# EAGLE design ReceiverR3 (EAGLE 8.4.2)
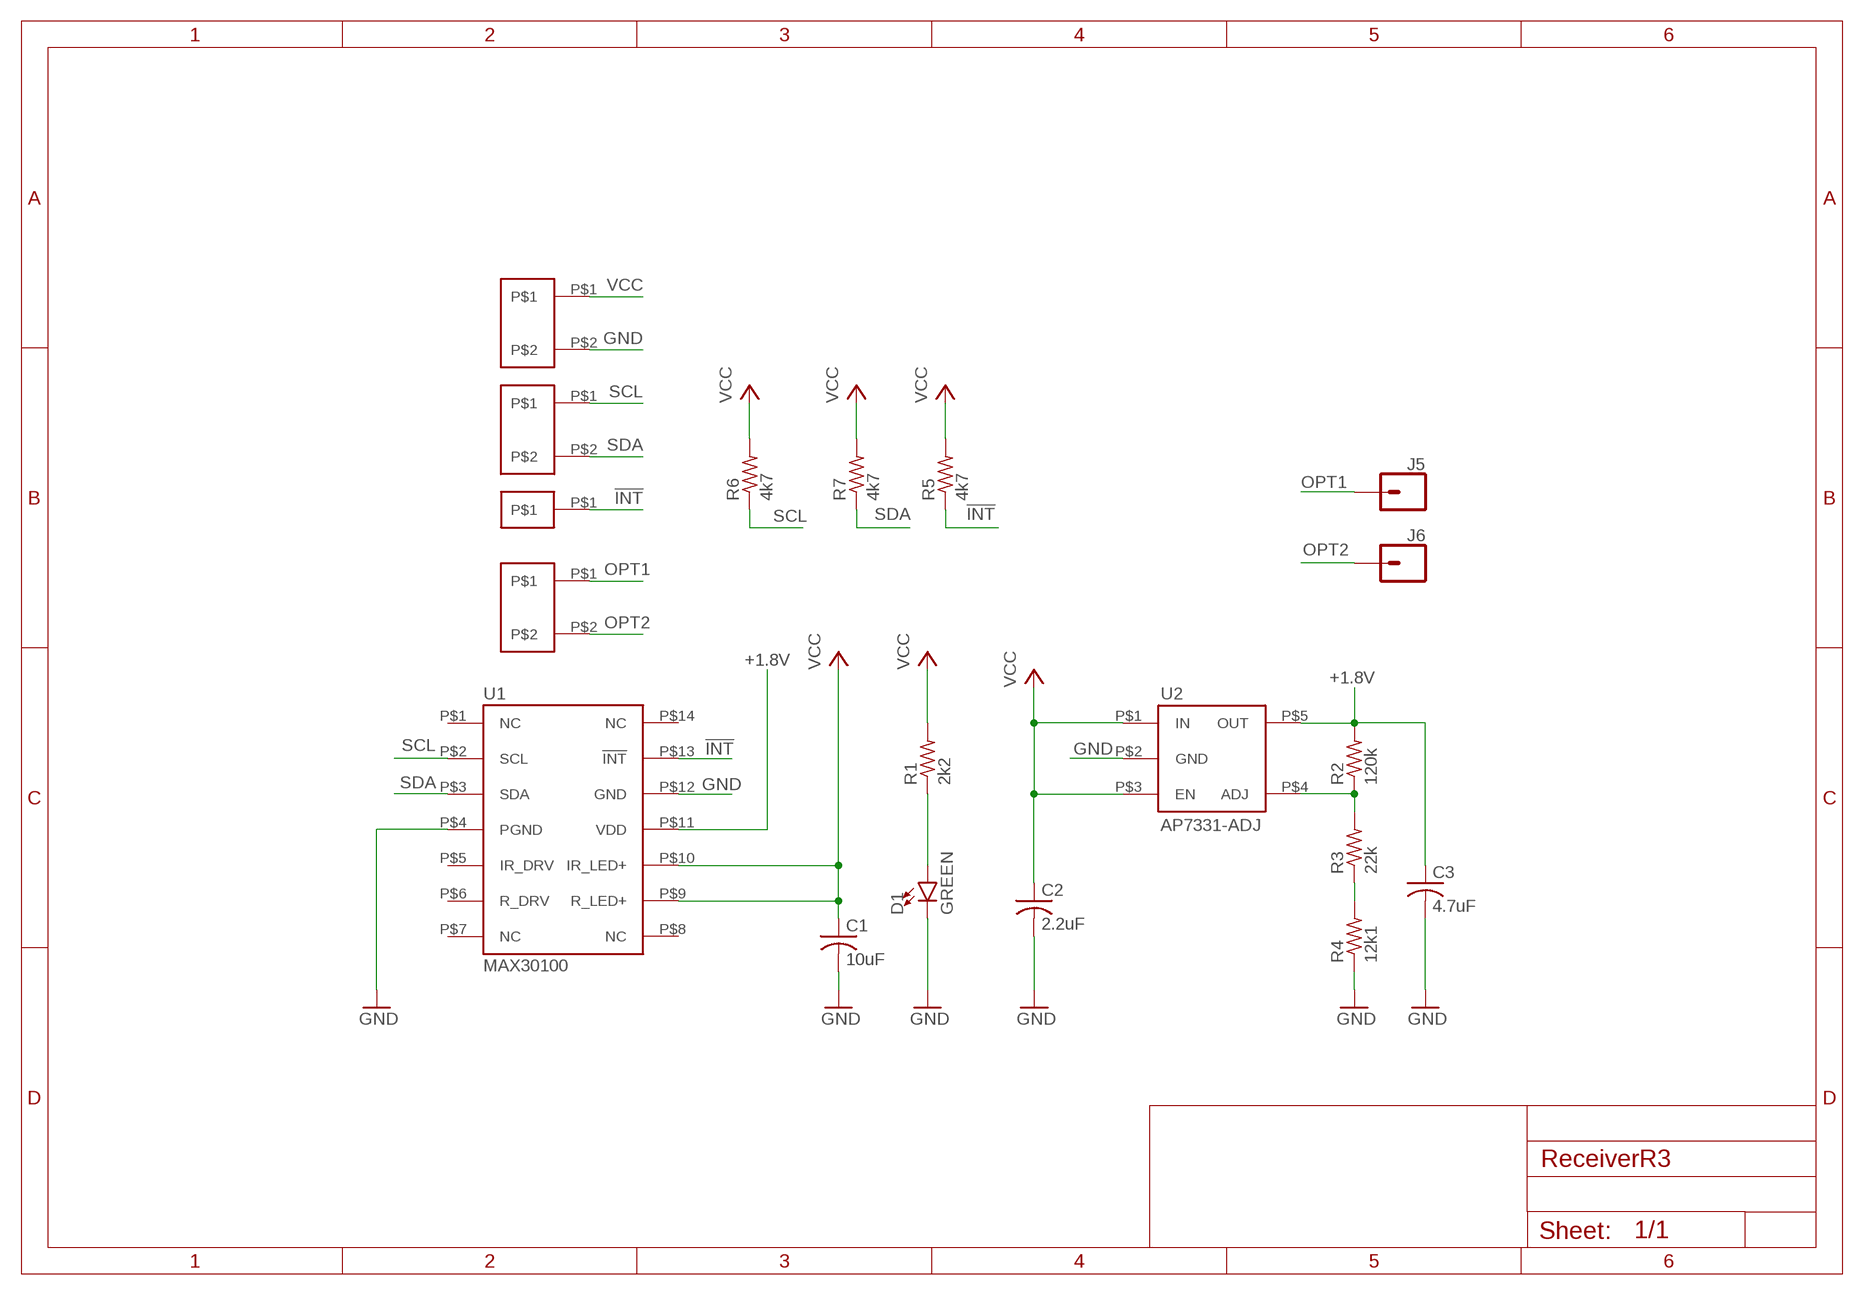
[diagram p0: schematic, sheet 1]

## Parts
C1  10uF  C-USC0805  [C0805]
C2  2.2uF  C-USC0805  [C0805]
C3  4.7uF  C-USC0805  [C0805]
D1  GREEN  LED-GREEN0603  [LED-0603]
J1  SOLDERPAD1X2  [SOLDERPAD1X2]
J2  SOLDERPAD1X2  [SOLDERPAD1X2]
J3  SOLDERPAD1X2  [SOLDERPAD1X2]
J4  SOLDERPAD1X1  [SOLDERPAD1X1]
J5  CONN_01  [1X01]
J6  CONN_01  [1X01]
R1  2k2  R-US_R0805  [R0805]
R2  120k  R-US_R0805  [R0805]
R3  22k  R-US_R0805  [R0805]
R4  12k1  R-US_R0805  [R0805]
R5  4k7  R-US_R0805  [R0805]
R6  4k7  R-US_R0805  [R0805]
R7  4k7  R-US_R0805  [R0805]
U1  MAX30100  [14OESIP]
U2  AP7331-ADJ  [SOT25]

## Nets
!INT!: J4.P$1 R5.1 U1.P$13(!INT!)
+1.8V: C3.1 R2.2 U1.P$11(VDD) U2.P$5(OUT)
GND: C1.2 C2.2 C3.2 D1.C J2.P$2 R4.1 U1.P$4(PGND) U1.P$12(GND) U2.P$2(GND)
N$1: D1.A R1.1
N$2: R2.1 R3.2 U2.P$4(ADJ)
N$3: R3.1 R4.2
OPT1: J1.P$1 J5.1
OPT2: J1.P$2 J6.1
SCL: J3.P$1 R6.1 U1.P$2(SCL)
SDA: J3.P$2 R7.1 U1.P$3(SDA)
VCC: C1.1 C2.1 J2.P$1 R1.2 R5.2 R6.2 R7.2 U1.P$9(R_LED+) U1.P$10(IR_LED+) U2.P$1(IN) U2.P$3(EN)
Unconnected: U1.P$1(NC) U1.P$5(IR_DRV) U1.P$6(R_DRV) U1.P$7(NC) U1.P$8(NC) U1.P$14(NC)

## Library data of the parts
C1-C3 = rcl:C-US: CAPACITOR, American symbol
D1 = SparkFun-LED:LED-GREEN: Green SMD LED Used in manufacturing of various products at SparkFun Packages: 0603 - SMD 0603 package [Product Link] <http://www.futureelectronics.com/en/technologies/semiconductors/optoelectronics/leds/Pages/9894312-LTST-C190GKT.aspx?CrossPart=HSMG-C190&IM=0> LilyPad 1206 - SMD1206 LilyPad package [Product Link] <http://www.futureelectronics.com/en/Technologies/Product.aspx?ProductID=IN150NGHARVATEKCORPORATION2049943&IM=0> 1206 - SMD1206 package [Product Link] <http://www.futureelectronics.com/en/technologies/semiconductors/optoelectronics/leds/Pages/8315665-LTST-C150KGKT.aspx?IM=0> 1206 Bottom Mount -SMD 1206 Bottom Mount [Product Link] <http://www.digikey.com/product-detail/en/lite-on-inc/LTST-C230KGKT/160-1456-1-ND/386854> SparkFun Products: Pro Mini 328 -5V <https://www.sparkfun.com/products/821> RedBoard <https://www.sparkfun.com/products/12757> MP3 Trigger <https://www.sparkfun.com/products/13720> Makey Makey <https://www.sparkfun.com/products/11076>; PROD_ID: DIO-00821
J1-J3 = CustomLibrary:SOLDERPAD1X2
J4 = CustomLibrary:SOLDERPAD1X1
J5 J6 = SparkFun-Connectors:CONN_01: Single connection point. Often used as Generic Header-pin footprint for 0.1 inch spaced/style header connections On any of the 0.1 inch spaced packages, you can populate with these: Break Away Headers - Straight <https://www.sparkfun.com/products/116> (PRT-00116) Break Away Male Headers - Right Angle <https://www.sparkfun.com/products/553> (PRT-00553) Female Headers <https://www.sparkfun.com/products/115> (PRT-00115) Break Away Headers - Machine Pin <https://www.sparkfun.com/products/117> (PRT-00117) Break Away Female Headers - Swiss Machine Pin <https://www.sparkfun.com/products/743> (PRT-00743) This device is also useful as a general connection point to wire up your design to another part of your project. Our various solder wires solder well into these plated through hole pads. Hook-Up Wire - Assortment (Stranded, 22 AWG) <https://www.sparkfun.com/products/11375> (PRT-11375) Hook-Up Wire - Assortment (Solid Core, 22 AWG) <https://www.sparkfun.com/products/11367> (PRT-11367) View the entire wire category on our website here <https://www.sparkfun.com/categories/141> Special notes: SMTSO-256-ET is a "flush mount" nut for a 4-40 screw. We mostly use this on specialty testbeds; it is a nice way to connect hardware to your PCB at an adjustable hieght. Also note, the SNAP packages are for using a snappable style connector. We sell a baggie of snaps and they are also used on two LilyPad designs: Snap Assortment - 30 pack (male and female) <https://www.sparkfun.com/products/11347> (DEV-11347) LilyPad Arduino SimpleSnap <https://www.sparkfun.com/products/10941> (DEV-10941) LilyPad SimpleSnap Protoboard <https://www.sparkfun.com/products/10940> (DEV-10940)
R1-R7 = rcl:R-US_: RESISTOR, American symbol
U1 = CustomLibrary:MAX30100: MAX30100
U2 = CustomLibrary:AP7331-ADJ: AP7331-ADJ

## Board
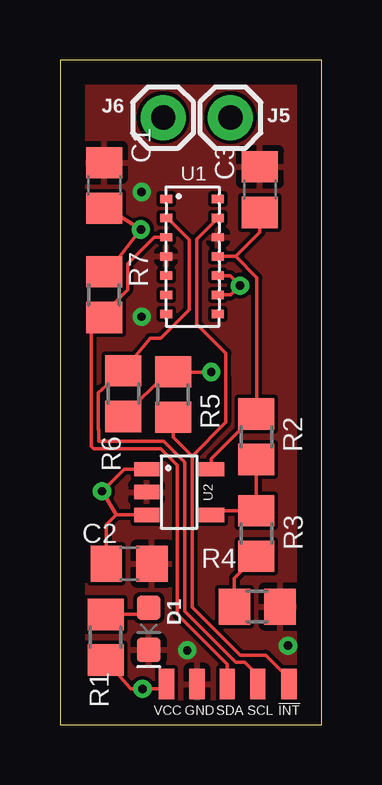
[diagram p1: board, top side]
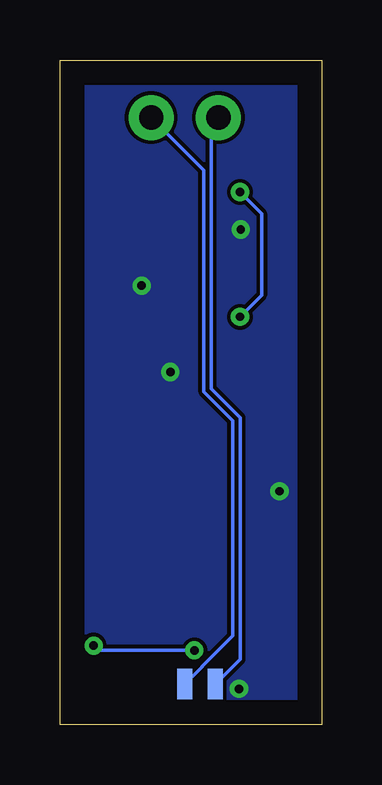
[diagram p2: board, bottom side, seen from below]

Size 10.9 x 27.7 mm. Coordinates in mm from the lower left corner, seen from the top.
Outline: 0,0 10.9,0 10.9,27.7 0,27.7 0,0
Copper layers (1*16): Top 0.035mm / dielectric 1.5mm / Bottom 0.035mm
Design rules "default": minimum track width 6mil, minimum drill 0.35mm, track to track 6mil, track to pad 6mil, pad to pad 6mil, via to via 6mil, smd to smd 6mil, copper to edge 40mil, drill to drill 6mil, minimum pad ring 10mil, minimum via ring 8mil, stop-mask expansion 4mil, vias tented up to drill 0mil, thermal gap 10mil

### Footprints (pad centres in the part's own frame; a part is rotated, then mirrored left to right if it is on the bottom)
C0805 = smd 1.3 x 1.5: 1 -0.95,0; 2 0.95,0
LED-0603 = smd 1 x 1: A -0.877,0; C 0.877,0
SOLDERPAD1X2 = smd 1.27 x 0.635: P$1 0,0; P$2 0,-1.27
SOLDERPAD1X1 = smd 1.27 x 0.635: P$1 0,0
1X01 = drill 1.016 pad 1.88: 1 0,0
R0805 = smd 1.3 x 1.5: 1 -0.95,0; 2 0.95,0
14OESIP = smd 0.5 x 0.35: P$1 0,0; P$2 0,-0.8; P$3 0,-1.6; P$4 0,-2.4; P$5 0,-3.2; P$6 0,-4; P$7 0,-4.8; P$8 2.15,-4.8; P$9 2.15,-4; P$10 2.15,-3.2; P$11 2.15,-2.4; P$12 2.15,-1.6; P$13 2.15,-0.8; P$14 2.15,0
SOT25 = smd 0.6 x 1.05: P$1 0,0; P$2 0.95,0; P$3 1.9,0; P$4 1.9,2.7; P$5 0,2.7

### Placement (x,y rotation side)
C1  1.84,22.47 90 top
C2  2.88,6.71 0 top
C3  8.33,22.3 90 top
D1  3.7,4 270 top
J1  5.7,1.7 90 bottom
J2  4.44,1.7 90 top
J3  8.24,1.7 270 top
J4  9.54,1.7 90 top
J5  7.1,25.3 0 top
J6  4.3,25.3 0 top
R1  1.9,3.65 270 top
R2  8.18,12 90 top
R3  8.18,7.97 90 top
R4  8.22,4.92 180 top
R5  4.71,13.76 90 top
R6  2.65,13.8 270 top
R7  1.84,17.92 90 top
U1  4.43,21.91 0 top
U2  3.61,10.65 270 top

### Tracks (layer width: path | path; a pad name or v marks a point on that pad's centre or on a via)
!INT!
  Top 0.152: U1.P$13 5.7,20.23 5.7,16.7 6.91,15.49 6.91,14.45 6.9,14.44 6.9,12.6 5.5,11.2 | J4.P$1 9.62,1.7 9.62,1.86 8.57,2.9 7.5,2.9 5.5,4.91 5.5,11.2 | R5.1 4.71,11.98 5.5,11.2
+1.8V
  Top 0.152: 8.33,21.27 C3.1 8.33,20.53 7.31,19.51 | U1.P$11 7.31,19.51 | 7.31,19.51 8.21,18.62 8.21,12.97 R2.2 6.31,11.08 U2.P$5
GND  (via drill 0.35)
  Bottom 0.152: v3.4,22.2 2.5,21.3 2.5,17.9 v3.4,17 | v5.3,3.1 9.3,3.1 v9.5,3.3
  pour Top: 0.2,27 0.2,0.2 10.8,0.2 10.7,0.3 10.7,27
N$1
  Top 0.152: R1.1 3.42,4.6 D1.A
N$2
  Top 0.152: U2.P$4 6.48,8.92 R3.2 R2.1
N$3
  Top 0.152: R3.1 7.27,6.11 R4.2
OPT1
  Bottom 0.152: J1.P$1 4.98,2.42 4.98,2.43 3.71,3.7 3.71,12.67 4.91,13.87 4.91,23.11 J5.1
OPT2
  Bottom 0.152: J1.P$2 3.4,2.73 3.4,12.8 4.6,14 4.6,25 J6.1
SCL
  Top 0.152: U1.P$2 4.49,21.11 5.39,20.21 5.39,17.3 4.19,16.1 3.76,16.1 R6.1 | R6.1 2.54,14.71 | R6.1 1.6,13.84 1.6,12.3 1.6,12.29 1.6,11.8 4.33,11.8 5.2,10.94 5.2,4.74 7.33,2.6 7.7,2.6 8.24,2.06 J3.P$1
SDA
  Top 0.152: 7.04,1.73 J3.P$2 6.97,2.53 4.89,4.61 4.89,10.81 4.2,11.5 1.4,11.5 1.3,11.6 1.3,12.17 1.29,12.17 1.29,12.4 1.29,12.41 1.29,16.42 R7.1 1.84,17.15 2.82,18.13 2.82,19.21 3.92,20.31 U1.P$3
VCC  (via drill 0.35)
  Top 0.152: U2.P$1 2.67,10.65 v1.75,9.73 2.33,8.75 | U2.P$3 2.33,8.75 | U1.P$10 7.09,18.71 v7.5,18.3 7.11,17.91 U1.P$9 | 2.33,8.75 1.93,8.34 C2.1 | 1.94,18.93 2.1,19.01 | 1.94,18.93 R7.2 | R1.2 2.94,1.5 v3.44,1.5 4.24,1.5 J2.P$1 | R6.2 4.51,14.71 R5.2 4.73,14.7 v6.3,14.7 | 1.94,18.93 2.02,18.93 v3.37,20.64 1.98,21.52 C1.1
  pour Bottom: 0.4,26.9 10.6,26.9 10.5,0.4 0.5,0.6

### Text on the board
tPlace: VCC | GND | SDA | SCL | !INT!